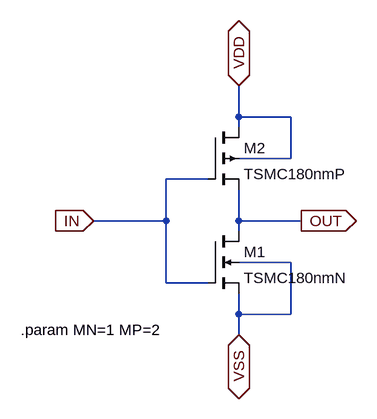
[diagram p0: schematic INV.asc]
INV.asc, the LTspice schematic file:
Version 4
SHEET 1 880 680
WIRE 480 80 480 32
WIRE 560 80 480 80
WIRE 480 96 480 80
WIRE 560 144 560 80
WIRE 560 144 480 144
WIRE 432 176 368 176
WIRE 368 240 368 176
WIRE 368 240 256 240
WIRE 480 240 480 192
WIRE 576 240 480 240
WIRE 480 256 480 240
WIRE 560 304 480 304
WIRE 368 336 368 240
WIRE 432 336 368 336
WIRE 480 384 480 352
WIRE 560 384 560 304
WIRE 560 384 480 384
WIRE 480 416 480 384
FLAG 256 240 IN
IOPIN 256 240 In
FLAG 576 240 OUT
IOPIN 576 240 Out
FLAG 480 32 VDD
IOPIN 480 32 BiDir
FLAG 480 416 VSS
IOPIN 480 416 BiDir
SYMBOL nmos4 432 256 R0
SYMATTR InstName M1
SYMATTR Value TSMC180nmN
SYMATTR Value2 l=200nm w=300nm ad=0 as=0 pd=0 ps=0 m={MN}
SYMBOL pmos4 432 96 R0
SYMATTR InstName M2
SYMATTR Value TSMC180nmP
SYMATTR Value2 l=200nm w=300nm ad=0 as=0 pd=0 ps=0 m={MP}
TEXT 144 408 Left 2 !.param MN=1 MP=2

The netlist it stands for:
* INV.asc
M1 OUT IN VSS VSS TSMC180nmN l=200nm w=300nm ad=0 as=0 pd=0 ps=0 m={MN}
M2 VDD IN OUT VDD TSMC180nmP l=200nm w=300nm ad=0 as=0 pd=0 ps=0 m={MP}
.model NMOS NMOS
.model PMOS PMOS
.lib standard.mos
.param MN=1 MP=2
.backanno
.end